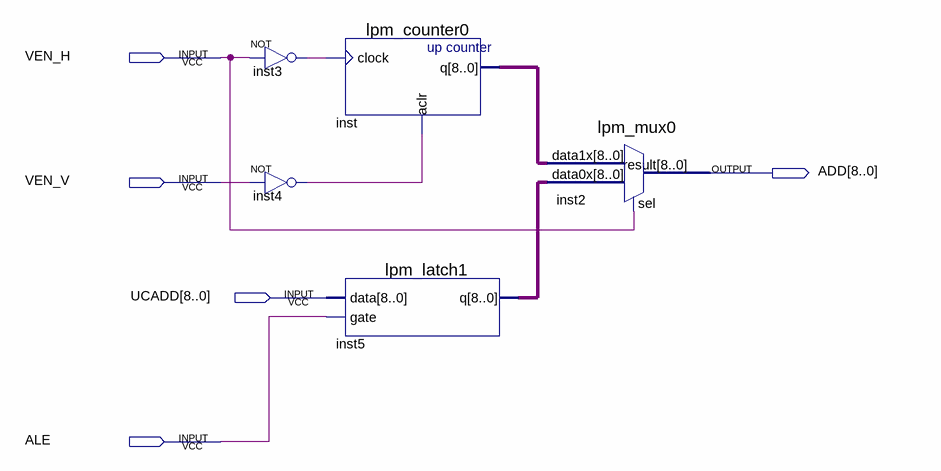
[diagram p0: schematic sheet]
// Quartus schematic VGA3.bdf as structural Verilog: 5 symbols, 5 pins
module VGA3 (
  input  VEN_H,
  input  VEN_V,
  input  [8:0] UCADD,
  input  ALE,
  output [8:0] ADD
);

  wire inst3_out, inst4_out;
  wire [8:0] inst5_q, inst_q;

  not inst3 (inst3_out, VEN_H);
  not inst4 (inst4_out, VEN_V);
  lpm_counter0 inst (.clock(inst3_out), .aclr(inst4_out), .q(inst_q));
  lpm_latch1 inst5 (.data(UCADD), .gate(ALE), .q(inst5_q));
  lpm_mux0 inst2 (.data1x(inst_q), .data0x(inst5_q), .sel(VEN_H), .result(ADD));
endmodule
